# EasyEDA Pro project ProPrj_位置判断手环_2025-10-22.epro

# Schematic Schematic1
Board Name: Board1; Create Date: 2025-09-14; Page Name: P1; Project Name: 位置判断手环; Schematic Name: Schematic1; Update Date: 2025-09-14; Company: 嘉立创EDA; Page Size: A4; Version: V1.0
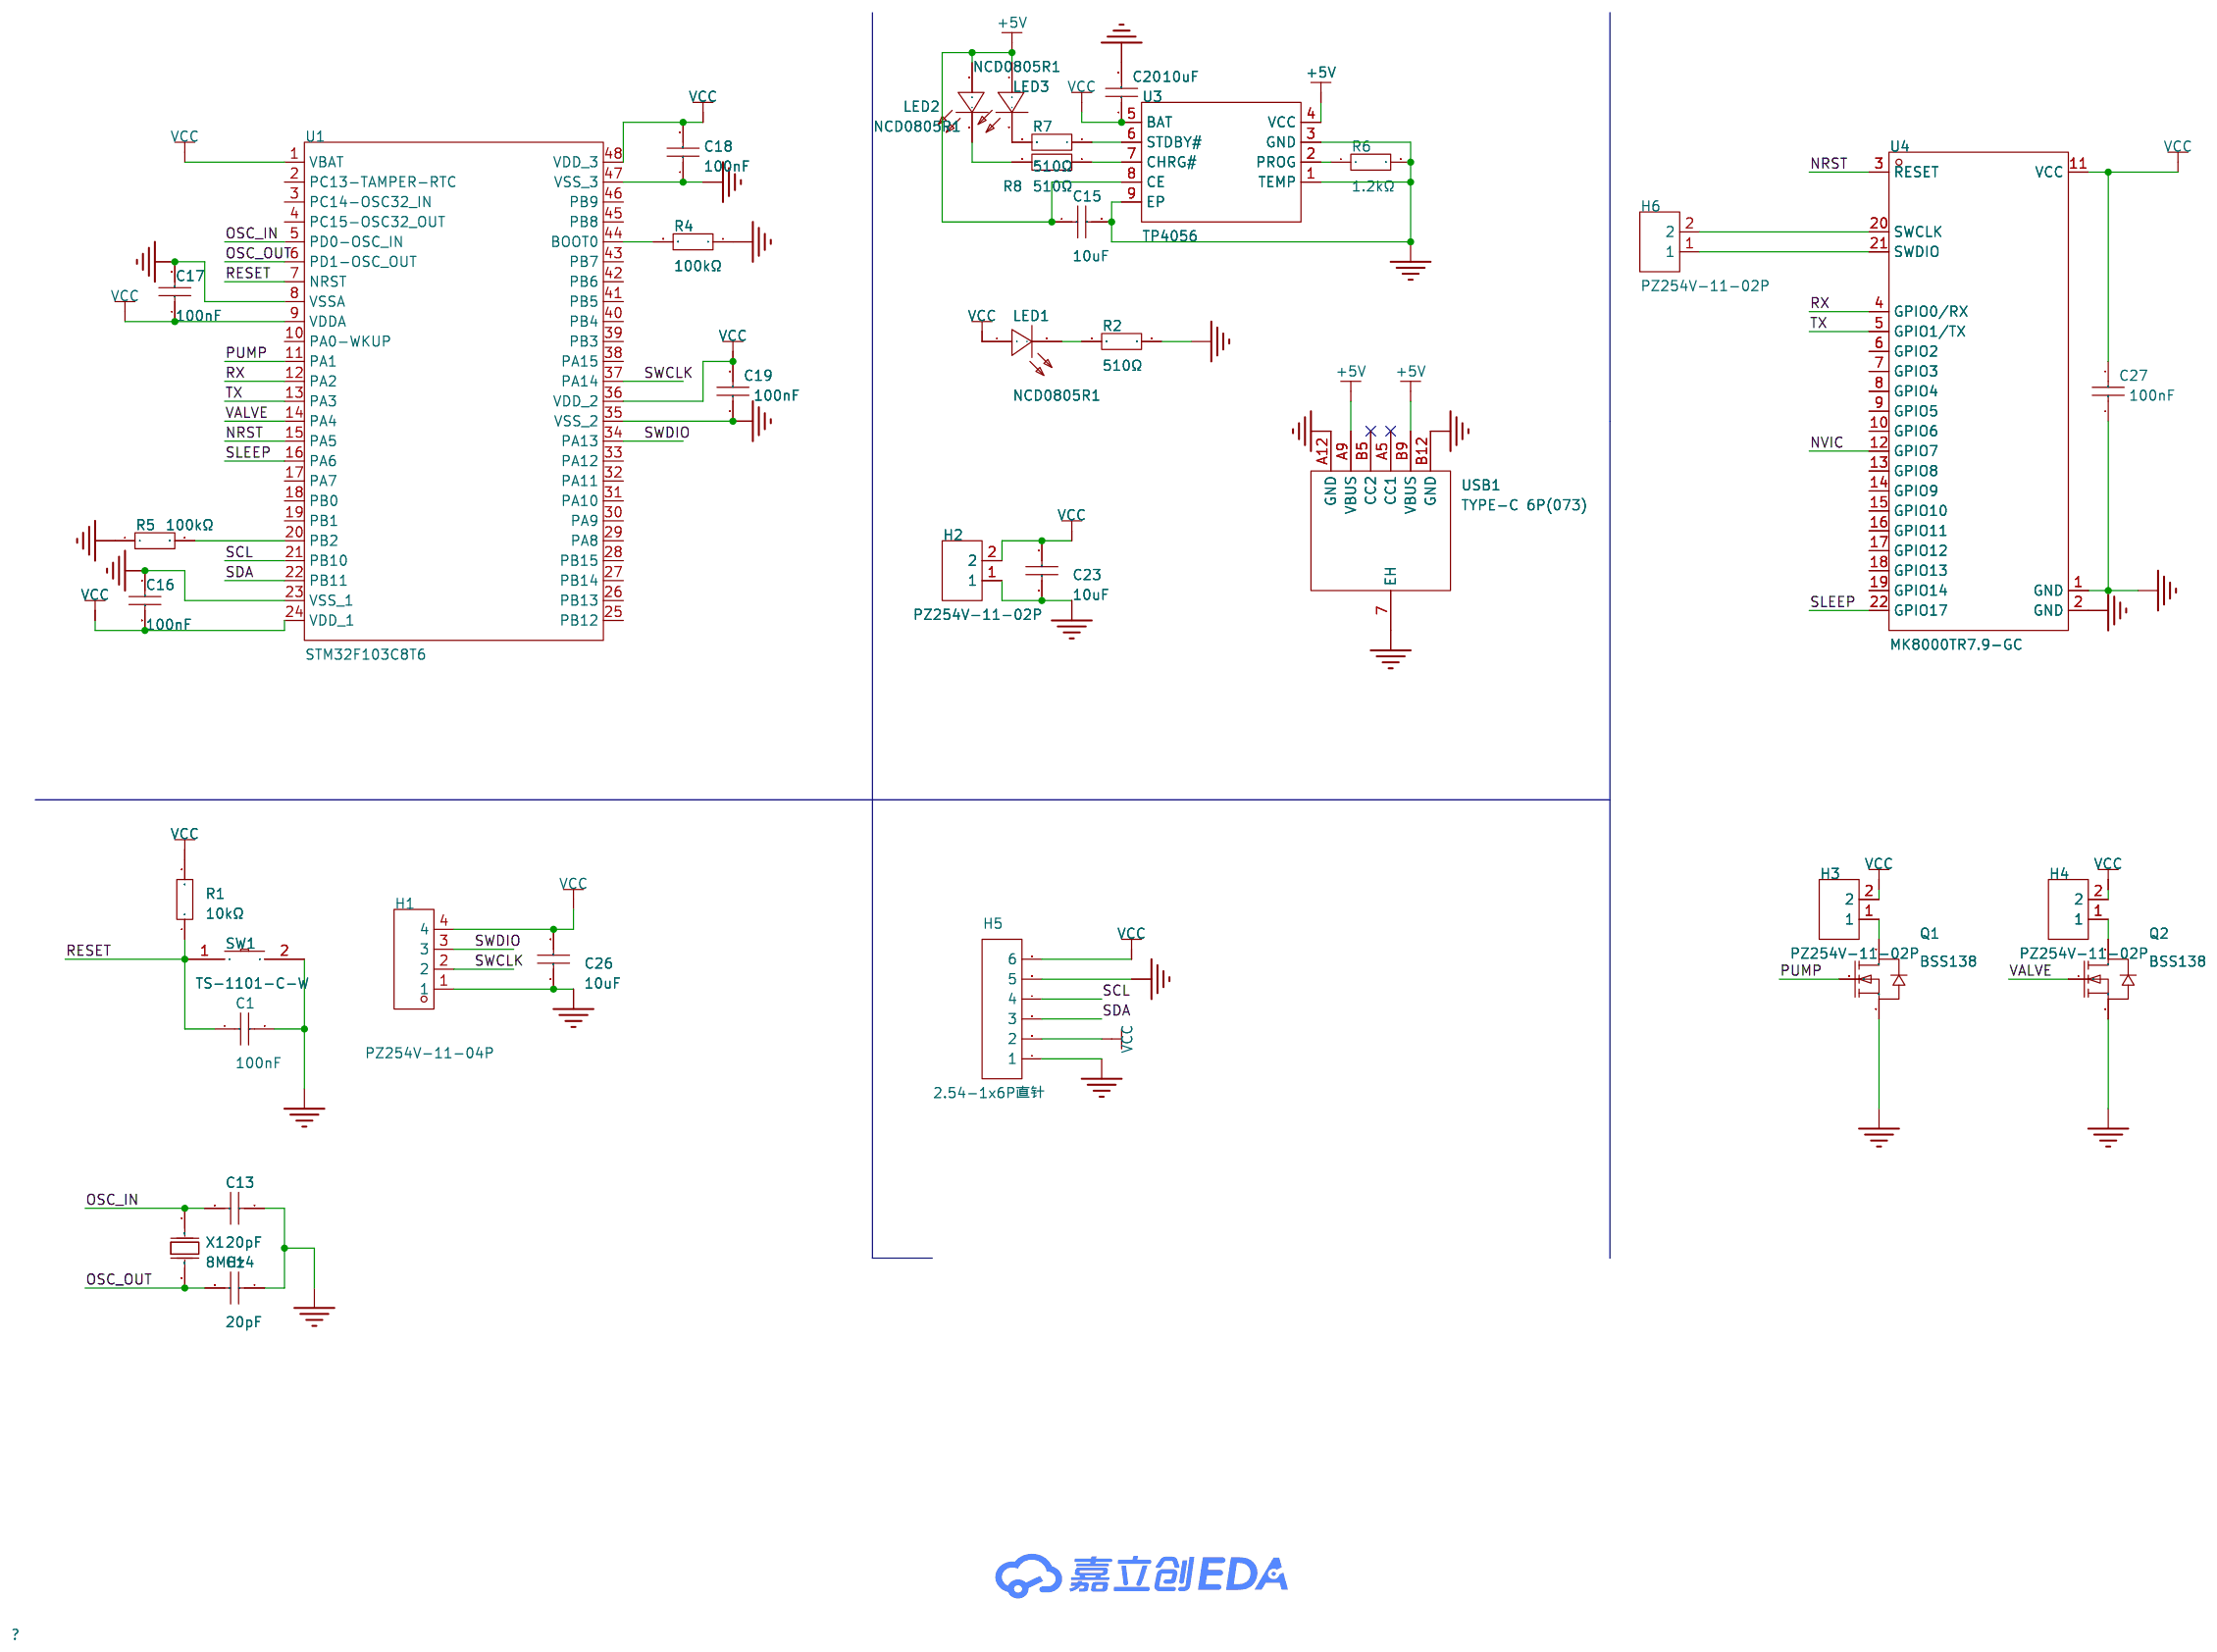
[diagram p0: schematic sheet]

## Parts
C1  100nF  [C0805]
C13  20pF  [C0805]
C14  20pF  [C0805]
C15  10uF  [C0805]
C16  100nF  [C0805]
C17  100nF  [C0805]
C18  100nF  [C0805]
C19  100nF  [C0805]
C20  10uF  [C0805]
C23  10uF  [C0805]
C26  10uF  [C0805]
C27  100nF  [C0805]
H1  PZ254V-11-04P  [HDR-TH_4P-P2.54-V-M]
H2  PZ254V-11-02P  [HDR-TH_2P-P2.54-V-M]
H3  PZ254V-11-02P  [HDR-TH_2P-P2.54-V-M]
H4  PZ254V-11-02P  [HDR-TH_2P-P2.54-V-M]
H5  2.54-1x6P直针  [HDR-TH_6P-P2.54-V-M-1]
H6  PZ254V-11-02P  [HDR-TH_2P-P2.54-V-M]
LED1  NCD0805R1  [LED0805-R-RD]
LED2  NCD0805R1  [LED0805-R-RD]
LED3  NCD0805R1  [LED0805-R-RD]
Q1  BSS138  [SOT-23-3_L2.9-W1.3-P1.90-LS2.4-BR]
Q2  BSS138  [SOT-23-3_L2.9-W1.3-P1.90-LS2.4-BR]
R1  10kΩ  [R0805]
R2  510Ω  [R0805]
R4  100kΩ  [R0805]
R5  100kΩ  [R0805]
R6  1.2kΩ  [R0603]
R7  510Ω  [R0805]
R8  510Ω  [R0805]
SW1  TS-1101-C-W  [SW-SMD_L6.0-W3.3-LS8.0]
U1  STM32F103C8T6  [LQFP-48_L7.0-W7.0-P0.50-LS9.0-BL]
U3  TP4056  [ESOP-8_L4.9-W3.9-P1.27-LS6.0-BL-EP]
U4  MK8000TR7.9-GC  [COMM-SMD_L26.3-W16.1_MK8000TR7.9-GC]
USB1  TYPE-C 6P(073)  [TYPE-C-SMD_TYPE-C-6P-073]
X1  8MHz  [CRYSTAL-SMD_L11.5-W4.8-LS12.7]

## Library data of the parts
C1 C16-C19 C27 = CL21B104KBCNNNC: 容值:100nF;精度:±10%;额定电压:50V;材质(温度系数):X7R;; LCSC Part Name: 100nF ±10% 50V; Supplier Part: C1711; Manufacturer: SAMSUNG(三星); Supplier Footprint: 0805; JLCPCB Part Class: 扩展库; Datasheet: https://atta.szlcsc.com/upload/public/pdf/source/20160218/1457707763339.pdf; Supplier: LCSC; Tolerance: ±10%; Voltage Rated: 50V; Temperature Coefficient: X7R
C13 C14 = CL21C200JBANNNC: 容值:20pF;精度:±5%;额定电压:50V;材质(温度系数):C0G;; LCSC Part Name: 20pF ±5% 50V; Supplier Part: C1798; Manufacturer: SAMSUNG(三星); Supplier Footprint: 0805; JLCPCB Part Class: 基础库; Datasheet: https://atta.szlcsc.com/upload/public/pdf/source/20160218/1457707763339.pdf; Supplier: LCSC; Tolerance: ±5%; Voltage Rated: 50V; Temperature Coefficient: C0G
C15 C20 C23 C26 = CL21A106KOQNNNE: 容值:10uF;精度:±10%;额定电压:16V;温度系数:X5R;; LCSC Part Name: 10uF ±10% 16V; Supplier Part: C1713; Manufacturer: SAMSUNG(三星); Supplier Footprint: 0805; JLCPCB Part Class: 扩展库; Datasheet: https://item.szlcsc.com/datasheet/CL21A106KOQNNNE/2065.html; Supplier: LCSC; Tolerance: ±10%; Voltage Rating: 16V; Temperature Coefficient: X5R
H1 = PZ254V-11-04P: 插针结构:1x4P;间距:2.54mm;行距:-;圆针/方针:方针;安装类型:直插;排数:单排;总PIN位数:4P;额定电流:3A;额定电压:250V;配合针长度:6mm;塑高:2.5mm;端接针长度:3mm;触头材质:-;工作温度范围:-40℃~+105℃;颜色:黑色;; LCSC Part Name: 间距:2.54mm 1x4P 直插 方针; Supplier Part: C2691448; Manufacturer: XFCN(兴飞); Supplier Footprint: 插件,P=2.54mm; JLCPCB Part Class: 扩展库; Datasheet: https://atta.szlcsc.com/upload/public/pdf/source/20200309/C492403_F9F19131791D08044AD4F84F8E751A34.pdf; Supplier: LCSC; Pin Structure: 1x4P; Pitch: 2.54mm; Circluar Pins/Square Pins: 方针; Mounting Type: 直插; Number of Rows: 单排; Number of Pins: 4P; Current Rating (Max): 3A; Voltage Rating (Max): 250V; Length of Mating Pin: 6mm; Insulation Height: 2.5mm; Length of End Connection Pin: 3mm; Operating Temperature Range: -40℃~+105℃; Color: 黑色
H2-H4 H6 = PZ254V-11-02P: 插针结构:1x2P;间距:2.54mm;行距:-;圆针/方针:方针;安装方式:直插;排数:单排;总PIN位数:2P;额定电流:-;额定电压:-;配合针长度:6mm;塑高:2.5mm;端接针长度:3mm;触头材质:黄铜;触头镀层:-;工作温度:-40℃~+105℃;颜色:黑色;; LCSC Part Name: 1x2P 间距:2.54mm 方针 直插; Supplier Part: C492401; Manufacturer: XFCN(兴飞); Supplier Footprint: 插件,P=2.54mm; JLCPCB Part Class: 扩展库; Datasheet: https://item.szlcsc.com/datasheet/PZ254V-11-02P/502957.html; Supplier: LCSC; Pin Structure: 1x2P; Pitch: 2.54mm; Circluar Pins/Square Pins: 方针; Mounting Type: 直插; Number of Rows: 单排; Number of Pins: 2P; Length of Mating Pin: 6mm; Insulation Height: 2.5mm; Length of End Connection Pin: 3mm; Contact Material: 黄铜; Operating Temperature: -40℃~+105℃; Color: 黑色
H5 = 2.54-1x6P直针: 插针结构:1x6P;间距:2.54mm;行距:-;圆针/方针:方针;安装方式:直插;排数:单排;总PIN位数:6P;额定电流:3A;额定电压:-;配合针长度:-;塑高:-;触头材质:黄铜;触头镀层:-;工作温度:-40℃~+105℃;颜色:黑色;; LCSC Part Name: 1x6P 间距:2.54mm 方针 直插; Supplier Part: C37208; Manufacturer: BOOMELE(博穆精密); Supplier Footprint: 插件,P=2.54mm; JLCPCB Part Class: 扩展库; Datasheet: https://atta.szlcsc.com/upload/public/pdf/source/20250115/42A019761A40C8B839643401D8CA5A96.pdf; Supplier: LCSC; Pin Structure: 1x6P; Pitch: 2.54mm; Circluar Pins/Square Pins: 方针; Mounting Type: 直插; Number of Rows: 单排; Number of Pins: 6P; Current Rating: 3A; Contact Material: 黄铜; Operating Temperature: -40℃~+105℃; Color: 黑色
LED1-LED3 = NCD0805R1: 灯头类型:-;发光颜色:红色;正向电压(VF):1.6V~2.6V;功率:65mW;正向电流:20mA;主波长:615nm~630nm;二极管配置:独立二极管;透镜颜色:无色透明透镜;色温:-;发光强度:67mcd~195mcd;发光角度:130°;载带方式:-;工作温度:-30℃~+85℃;; Supplier Part: C84256; Manufacturer: 国星光电; Supplier Footprint: 0805; JLCPCB Part Class: 基础库; Datasheet: https://atta.szlcsc.com/upload/public/pdf/source/20200820/C84256_F0A75A43B3EAD75808600A0514C76B99.pdf; Supplier: LCSC; Emitted Color: 红色; Forward Voltage (VF): 1.6V~2.6V; Power Dissipation: 65mW; Forward Current: 20mA; Dominant Wavelength: 615nm~630nm; Diode Configuration: 独立二极管; Lens Color: 无色透明透镜; Luminous Intensity: 67mcd~195mcd; Viewing Angle: 130°; Operating Temperature: -30℃~+85℃
Q1 Q2 = BSS138_C7420339: 数量:1个N沟道;漏源电压(Vdss):50V;连续漏极电流(Id):340mA;导通电阻(RDS(on)):1.1Ω@10V；1.2Ω@4.5V;耗散功率(Pd):350mW;阈值电压(Vgs(th)):1.2V@250uA;; LCSC Part Name: 1个N沟道 耐压:50V 电流:340mA; Supplier Part: C7420339; Manufacturer: R+O(宏嘉诚); Supplier Footprint: SOT-23; JLCPCB Part Class: 扩展库; Datasheet: https://item.szlcsc.com/datasheet/BSS138/8397161.html; Supplier: LCSC; Number: 1个N沟道; Drain to Source Voltage: 50V; Current - Continuous Drain(Id): 340mA; RDS(on): 1.1Ω@10V；1.2Ω@4.5V; Pd - Power Dissipation: 350mW; Gate Threshold Voltage (Vgs(th)): 1.2V@250uA; Gate Charge(Qg): 1.7nC@10V; Input Capacitance(Ciss): 17.5pF@25V; Reverse Transfer Capacitance (Crss@Vds): 6.5pF@25V; Operating Temperature: -55℃~+150℃; Type: N沟道
R1 = 0805W8F1002T5E_C17414: 电阻类型:厚膜电阻;阻值:10kΩ;精度:±1%;功率:125mW;工作电压:150V;温度系数:±100ppm/℃;; LCSC Part Name: 10kΩ ±1% 125mW 厚膜电阻; Supplier Part: C17414; Manufacturer: UNI-ROYAL(厚声); Manufacturer Part: 0805W8F1002T5E; Supplier Footprint: 0805; JLCPCB Part Class: 基础库; Datasheet: https://atta.szlcsc.com/upload/public/pdf/source/20200306/C422600_1E6D84923E4A46A82E41ADD87F860B5C.pdf; Supplier: LCSC; Type: 厚膜电阻; Tolerance: ±1%; Power(Watts): 125mW; Voltage-Supply(Max): 150V; Temperature Coefficient: ±100ppm/℃; Operating Temperature: -55℃~+155℃
R2 R7 R8 = 0805W8F5100T5E: 电阻类型:厚膜电阻;阻值:510Ω;精度:±1%;功率:125mW;最大工作电压:150V;温度系数:±100ppm/℃;; LCSC Part Name: 510Ω ±1% 125mW 厚膜电阻; Supplier Part: C17734; Manufacturer: UNI-ROYAL(厚声); Supplier Footprint: 0805; JLCPCB Part Class: 基础库; Datasheet: https://atta.szlcsc.com/upload/public/pdf/source/20200306/C422600_1E6D84923E4A46A82E41ADD87F860B5C.pdf; Supplier: LCSC; Type: 厚膜电阻; Tolerance: ±1%; Power(Watts): 125mW; Overload Voltage (Max): 150V; Temperature Coefficient: ±100ppm/℃; Operating Temperature Range: -55℃~+155℃
R4 R5 = 0805W8F1003T5E: 电阻类型:厚膜电阻;阻值:100kΩ;精度:±1%;功率:125mW;工作电压:150V;温度系数:±100ppm/℃;; LCSC Part Name: 100kΩ ±1% 125mW 厚膜电阻; Supplier Part: C149504; Manufacturer: UNI-ROYAL(厚声); Supplier Footprint: 0805; JLCPCB Part Class: 基础库; Datasheet: https://atta.szlcsc.com/upload/public/pdf/source/20200306/C422600_1E6D84923E4A46A82E41ADD87F860B5C.pdf; Supplier: LCSC; Type: 厚膜电阻; Tolerance: ±1%; Power(Watts): 125mW; Voltage-Supply(Max): 150V; Temperature Coefficient: ±100ppm/℃; Operating Temperature: -55℃~+155℃
R6 = 0603WAF1201T5E: 电阻类型:厚膜电阻;阻值:1.2kΩ;精度:±1%;功率:100mW;工作电压:75V;温度系数:±100ppm/℃;; LCSC Part Name: 1.2kΩ ±1% 100mW 厚膜电阻; Supplier Part: C22765; Manufacturer: UNI-ROYAL(厚声); Supplier Footprint: 0603; JLCPCB Part Class: 基础库; Datasheet: https://item.szlcsc.com/datasheet/0603WAF1201T5E/23492.html; Supplier: LCSC; Type: 厚膜电阻; Tolerance: ±1%; Power(Watts): 100mW; Voltage-Supply(Max): 75V; Temperature Coefficient: ±100ppm/℃; Operating Temperature: -55℃~+155℃
SW1 = TS-1101-C-W: 电路结构:单刀单掷;按钮形状:矩形按钮;作用力:260gf;安装方式:立贴;开关长度:6mm;开关宽度:3.6mm;开关高度:2.5mm;带支架:不带;触点电流:50mA;额定电压(AC):-;额定电压(DC):12V;额定功率:-;绝缘电阻:-;带灯:无;机械寿命:5万次;; LCSC Part Name: 6*3.6*2.5mm 立贴 轻触开关; Supplier Part: C318938; Manufacturer: XKB Connectivity(中国星坤); Supplier Footprint: SMD; JLCPCB Part Class: 扩展库; Datasheet: https://atta.szlcsc.com/upload/public/pdf/source/20200227/C318938_C2E53B1EEDE37D980A33616AC086DE53.pdf; Supplier: LCSC; Circuit: 单刀单掷; Actuator Style: 矩形按钮; Operating Force: 260gf; Mounting Style: 立贴; Switch Length: 6mm; Switch Width: 3.6mm; Switch Height: 2.5mm; Strike Gundam: 不带; Contact Current: 50mA; Voltage Rating (DC): 12V; Actuator/Cap Color: 白色带淡绿; With Lamp: 无; Mechanical Life: 5万次; Operating Temperature: -30℃~+85℃
U1 = STM32F103C8T6: CPU内核:ARM-M3;CPU最大主频:72MHz;应用领域:-;; LCSC Part Name: 主流增强型ARM Cortex-M3 MCU，具有64 KB Flash、72 MHz CPU、电机控制、USB和CAN; Supplier Part: C8734; Manufacturer: ST(意法半导体); Supplier Footprint: LQFP-48(7x7); JLCPCB Part Class: 扩展库; Datasheet: https://item.szlcsc.com/datasheet/STM32F103C8T6/9243.html; Supplier: LCSC; CPU Core: ARM-M3; CPU Maximum Speed: 72MHz; Program Storage Size: 64KB; Program Memory Type: FLASH; Number of I/O: 37; ADC (Bit): 12bit; Voltage - Supply: 2V~3.6V
U3 = TP4056_C725790: 工作电压:3.7V~6.5V;最大充电电流:1A;电池类型:锂离子;电池节数:1;; LCSC Part Name: 1A独立式线性锂离子电池充电器; Supplier Part: C725790; Manufacturer: UMW(友台半导体); Supplier Footprint: ESOP-8; JLCPCB Part Class: 扩展库; Datasheet: https://item.szlcsc.com/datasheet/TP4056/772193.html; Supplier: LCSC; The Chip Type: 线性充电芯片; Voltage - Supply: 3.7V~6.5V; Charge Current - Max: 1A; Charging Saturation Voltage: 4.2V; Type of Battery: 锂离子; Number of Cells: 1; Operating Temperature: -40℃~+85℃; Battery Temperature Detection: 支持; 0V Battery Charge: 支持; Supply Current (Iq): 35uA
U4 = MK8000TR7.9-GC: 国产UWB测距模块电子围栏应用; Supplier Part: C42382001; Manufacturer: Silicontra(硅传科技); Supplier Footprint: SMD,26.3x15.1mm; JLCPCB Part Class: Extended Part; Datasheet: https://atta.szlcsc.com/upload/public/pdf/source/20241115/1BBDFCDE45D079C44B86411E68911EA9.pdf; Supplier: LCSC
USB1 = TYPE-C 6P(073): 连接器类型:Type-C;标准:USB 3.1;公母:母;安装方式:卧贴;触点数量:6P;端口数量:1;额定电流 - 电源:3A;工作温度范围:-25℃~+85℃;; LCSC Part Name: Type-C 母 卧贴; Supplier Part: C668623; Manufacturer: SHOU HAN(首韩); Supplier Footprint: SMD; JLCPCB Part Class: 扩展库; Datasheet: https://atta.szlcsc.com/upload/public/pdf/source/20200618/C668623_A4B260DED7AC1949BAC6AE39E9F4CD80.pdf; Supplier: LCSC; Connector Type: Type-C; Standard: USB 3.1; Gender: 母; Mounting Style: 卧贴; Number of Contacts: 6P; Number of Ports: 1; Current Rating - Power (Max): 3A; Operating Temperature Range: -25℃~+85℃; Rated Voltage (Max): 5V; Connect-Disconnect Life: 1万次; Core Colour: 黑色
X1 = X49SM8MSD2SC: 晶振类型:贴片晶振;频率:8MHz;常温频差:±20ppm;负载电容:20pF;频率稳定度:±30ppm;; LCSC Part Name: HC-49SMD 8MHZ 2P 49SMD 20PF ±20PPM -20~70℃（±30PPM）; Supplier Part: C12674; Manufacturer: YXC(扬兴晶振); Supplier Footprint: HC-49S-SMD; JLCPCB Part Class: 基础库; Datasheet: https://item.szlcsc.com/datasheet/X49SM8MSD2SC/13310.html; Supplier: LCSC; Type: 贴片晶振; Normal temperature Frequency Tolerance: ±20ppm; Load Capacitance: 20pF; Frequency Stability: ±30ppm; Operating Temperature: -20℃~+70℃

## Nets
+5V: C15.1 LED2.1(+) LED3.1(+) U3.4(VCC) U3.8(CE) USB1.A9(VBUS) USB1.B9(VBUS)
GND: C1.2 C13.1 C14.1 C15.2 C16.1 C17.2 C18.1 C19.1 C20.2 C23.1 C26.1 C27.1 H1.1 H2.1 H5.1 H5.5 Q1.2(S) Q2.2(S) R2.2 R4.1 R5.1 R6.2 SW1.2 U1.8(VSSA) U1.23(VSS_1) U1.35(VSS_2) U1.47(VSS_3) U3.1(TEMP) U3.3(GND) U3.9(EP) U4.1(GND) U4.2(GND) USB1.7(EH) USB1.A12(GND) USB1.B12(GND)
VCC: C16.2 C17.1 C18.2 C19.2 C20.1 C23.2 C26.2 C27.2 H1.4 H2.2 H3.2 H4.2 H5.2 H5.6 LED1.1(+) R1.2 U1.1(VBAT) U1.9(VDDA) U1.24(VDD_1) U1.36(VDD_2) U1.48(VDD_3) U3.5(BAT) U4.11(VCC)
NRST: U1.15(PA5) U4.3(RESET)
NVIC: U4.12(GPIO7)
OSC_IN: C13.2 U1.5(PD0-OSC_IN) X1.1(OSC1)
OSC_OUT: C14.2 U1.6(PD1-OSC_OUT) X1.2(OSC2)
PUMP: Q1.1(G) U1.11(PA1)
RESET: C1.1 R1.1 SW1.1 U1.7(NRST)
RX: U1.12(PA2) U4.4(GPIO0/RX)
SCL: H5.4 U1.21(PB10)
SDA: H5.3 U1.22(PB11)
SLEEP: U1.16(PA6) U4.22(GPIO17)
SWCLK: H1.2 U1.37(PA14)
SWDIO: H1.3 U1.34(PA13)
TX: U1.13(PA3) U4.5(GPIO1/TX)
VALVE: Q2.1(G) U1.14(PA4)
$1N1122: R4.2 U1.44(BOOT0)
$1N1418: LED1.2(-) R2.1
$1N1827: R5.2 U1.20(PB2)
$1N2005: R6.1 U3.2(PROG)
$1N2241: R7.1 U3.6(STDBY#)
$1N2366: R8.1 U3.7(CHRG#)
$1N4541: H3.1 Q1.3(D)
$1N4547: H4.1 Q2.3(D)
$1N4625: LED3.2(-) R7.2
$1N4629: LED2.2(-) R8.2
$1N6746: H6.2 U4.20(SWCLK)
$1N6750: H6.1 U4.21(SWDIO)

Not connected (* = marked no-connect by the designer): U1 2(PC13-TAMPER-RTC) 3(PC14-OSC32_IN) 4(PC15-OSC32_OUT) 10(PA0-WKUP) 17(PA7) 18(PB0) 19(PB1) 25(PB12) 26(PB13) 27(PB14) 28(PB15) 29(PA8) 30(PA9) 31(PA10) 32(PA11) 33(PA12) 38(PA15) 39(PB3) 40(PB4) 41(PB5) 42(PB6) 43(PB7) 45(PB8) 46(PB9); U4 6(GPIO2) 7(GPIO3) 8(GPIO4) 9(GPIO5) 10(GPIO6) 13(GPIO8) 14(GPIO9) 15(GPIO10) 16(GPIO11) 17(GPIO12) 18(GPIO13) 19(GPIO14); USB1 A5(CC1)* B5(CC2)*

# Board PCB1
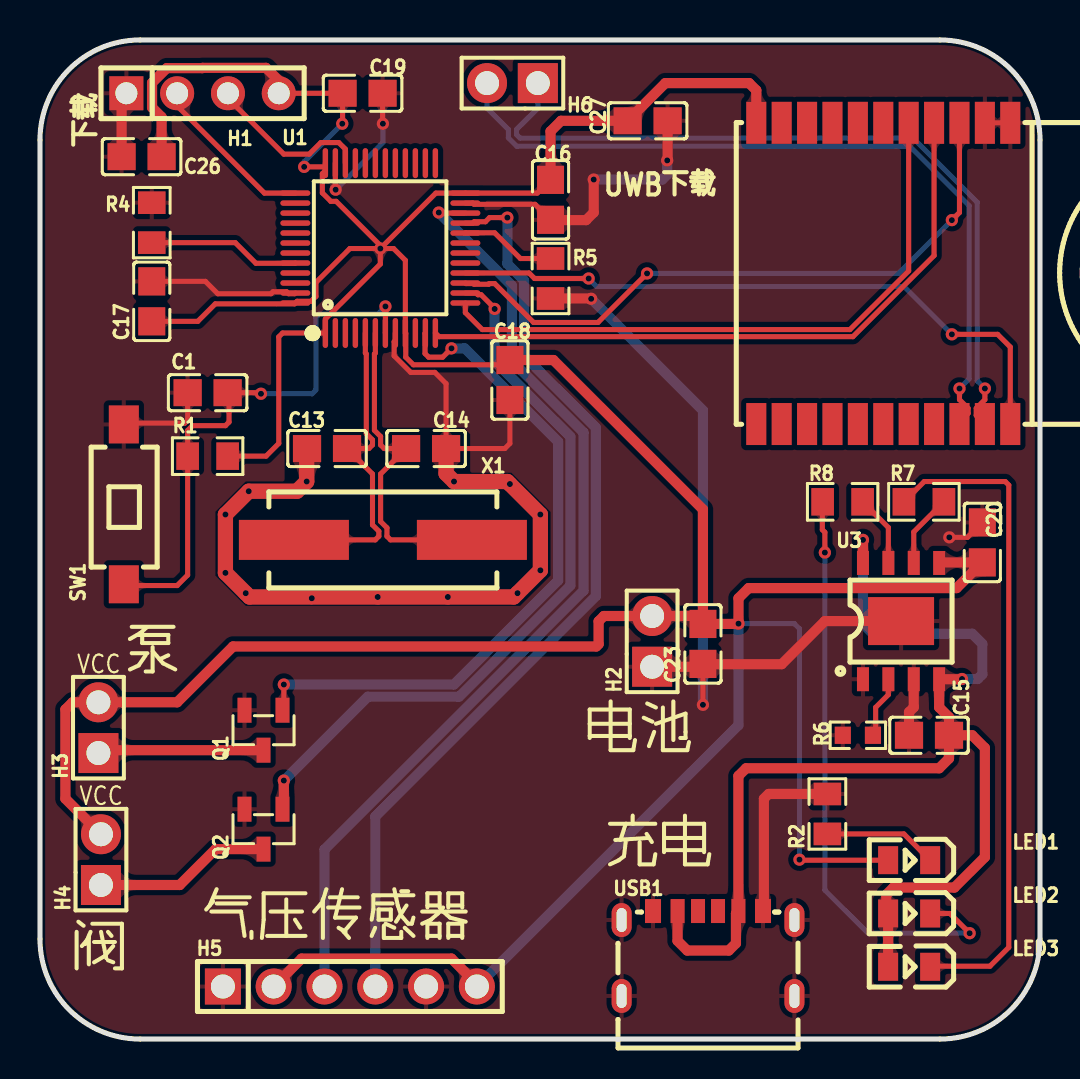
[diagram p1: board, top side]
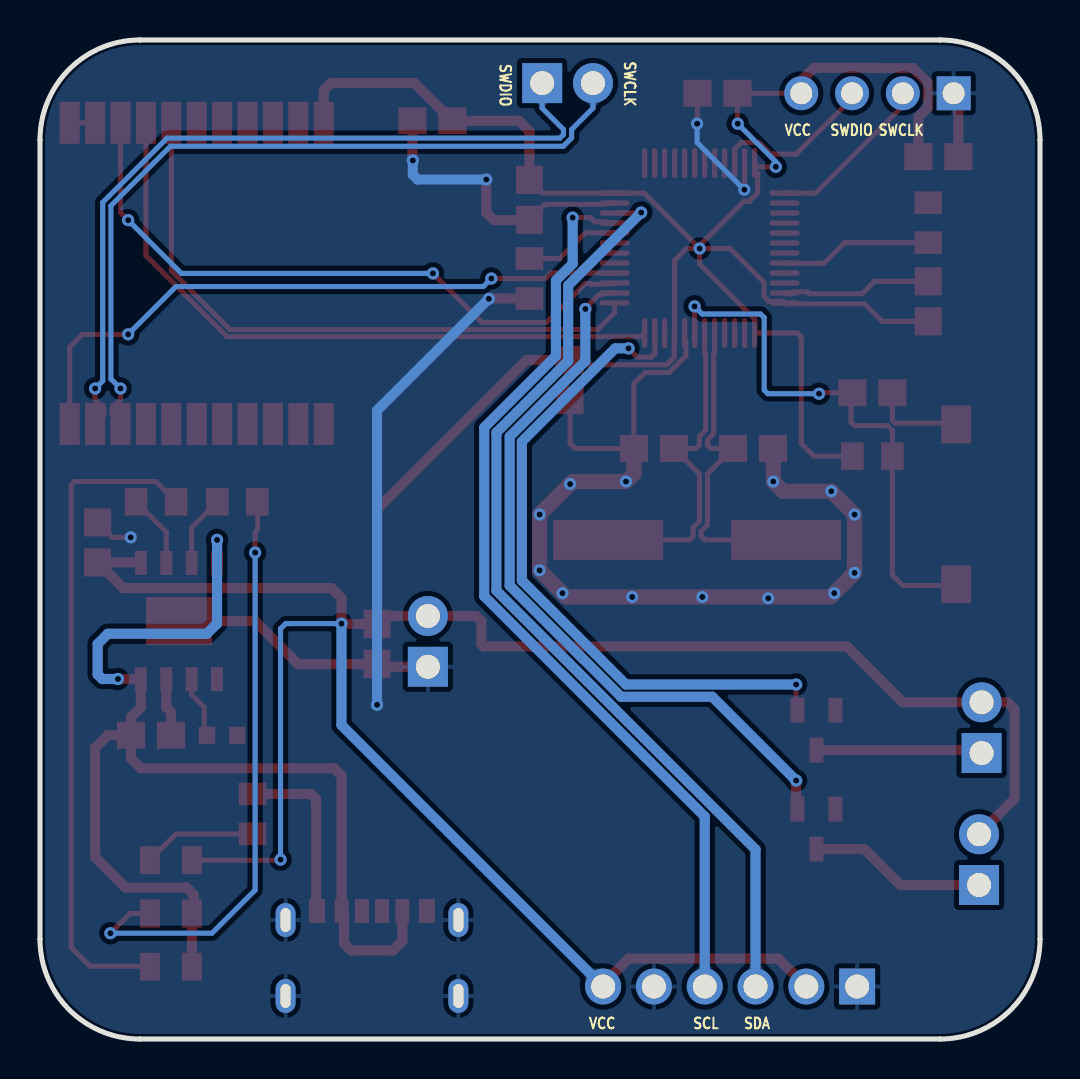
[diagram p2: board, bottom side, seen from below]

Outline 50 x 50 mm; copper layers: Top Layer, Bottom Layer. Coordinates in mm from the lower left corner of the outline.
Outline path: 0,45 0,5 arc(1.46,1.46) 5,0 45,0 arc(48.54,1.46) 50,5 50,45 arc(48.54,48.54) 45,50 5,50 arc(1.46,48.54) 0,45
Stack: Top Layer 0.035mm / Dielectric1 1.51mm FR4 er 4.5 / Bottom Layer 0.035mm

## Design rules (mm)
net OSC_IN: DP1
net OSC_OUT: DP1
net SWCLK: DP2
net SWDIO: DP2
net $1N6750: DP3
net $1N6746: DP3
template: JLCPCB Capability(Two Layers Board)
spacing copperThickness1oz (default): track to track 0.102, other pairs 0.152 to 0.3
spacing copperThickness2oz: track to track 0.203, other pairs 0.152 to 0.3
track width copperThickness1oz (default): min 0.127, default 0.254, max 2.54
track width copperThickness2oz: min 0.203, default 0.254, max 2.54
differential pair differentialPair (default): width min 0.127, default 0.254, max 2.54; gap min 0.152, default 0.152
via viaSize (default): diameter min 0.5, default 0.61, max 10; hole min 0.3, default 0.305, max 6.3

## Placement (name value [footprint] x y rotation side)
C1  100nF  [C0805]  8.38 32.35 180 top
C13  20pF  [C0805]  14.35 29.55 0 top
C14  20pF  [C0805]  19.3 29.55 180 top
C15  10uF  [C0805]  44.45 15.2 180 top
C16  100nF  [C0805]  25.53 42 90 top
C17  100nF  [C0805]  5.59 36.92 90 top
C18  100nF  [C0805]  23.49 32.98 90 top
C19  100nF  [C0805]  16.13 47.33 180 top
C20  10uF  [C0805]  47.12 24.85 90 top
C23  10uF  [C0805]  33.15 19.77 90 top
C26  10uF  [C0805]  5.08 44.16 0 top
C27  100nF  [C0805]  30.38 45.95 180 top
H1  PZ254V-11-04P  [HDR-TH_4P-P2.54-V-M]  8.13 47.33 0 top
H2  PZ254V-11-02P  [HDR-TH_2P-P2.54-V-M]  30.61 19.9 90 top
H3  PZ254V-11-02P  [HDR-TH_2P-P2.54-V-M]  2.92 15.58 90 top
H4  PZ254V-11-02P  [HDR-TH_2P-P2.54-V-M]  3.05 8.98 90 top
H5  2.54-1x6P直针  [HDR-TH_6P-P2.54-V-M-1]  15.49 2.63 0 top
H6  PZ254V-11-02P  [HDR-TH_2P-P2.54-V-M]  23.62 47.84 180 top
LED1  NCD0805R1  [LED0805-R-RD]  43.46 8.95 180 top
LED2  NCD0805R1  [LED0805-R-RD]  43.46 6.28 180 top
LED3  NCD0805R1  [LED0805-R-RD]  43.46 3.62 180 top
Q1  BSS138  [SOT-23-3_L2.9-W1.3-P1.90-LS2.4-BR]  11.18 15.46 90 top
Q2  BSS138  [SOT-23-3_L2.9-W1.3-P1.90-LS2.4-BR]  11.18 10.5 90 top
R1  10kΩ  [R0805]  8.38 29.17 0 top
R2  510Ω  [R0805]  39.37 11.26 90 top
R4  100kΩ  [R0805]  5.59 40.86 270 top
R5  100kΩ  [R0805]  25.53 38.06 90 top
R6  1.2kΩ  [R0603]  40.89 15.2 180 top
R7  510Ω  [R0805]  44.2 26.89 180 top
R8  510Ω  [R0805]  40.13 26.89 180 top
SW1  TS-1101-C-W  [SW-SMD_L6.0-W3.3-LS8.0]  4.19 26.76 90 top
U1  STM32F103C8T6  [LQFP-48_L7.0-W7.0-P0.50-LS9.0-BL]  17.02 39.59 0 top
U3  TP4056  [ESOP-8_L4.9-W3.9-P1.27-LS6.0-BL-EP]  43.05 20.92 0 top
U4  MK8000TR7.9-GC  [COMM-SMD_L26.3-W16.1_MK8000TR7.9-GC]  42.16 38.32 270 top
USB1  TYPE-C 6P(073)  [TYPE-C-SMD_TYPE-C-6P-073]  33.4 4.28 0 top
X1  8MHz  [CRYSTAL-SMD_L11.5-W4.8-LS12.7]  17.14 24.98 0 top

## Footprints (pads in the part's own frame, mm; a bottom-side part is the same pattern mirrored in y, then rotated)
C0805
  rect 1.41x1.35 smd: 1(-1,0) 2(1,0)
COMM-SMD_L26.3-W16.1_MK8000TR7.9-GC
  rect 2.102x1.002 smd: 1(-7.537,6.35) 2(-7.537,5.08) 3(-7.537,3.81) 4(-7.537,2.54) 5(-7.537,1.27) 6(-7.537,0) 7(-7.537,-1.27) 8(-7.537,-2.54) 9(-7.537,-3.81) 10(-7.537,-5.08) 11(-7.537,-6.35) 12(7.537,-6.35) 13(7.537,-5.08) 14(7.537,-3.81) 15(7.537,-2.54) 16(7.537,-1.27) 17(7.537,0) 18(7.537,1.27) 19(7.537,2.54) 20(7.537,3.81) 21(7.537,5.08) 22(7.537,6.35)
CRYSTAL-SMD_L11.5-W4.8-LS12.7
  rect 5.5x2 smd: 1(-4.45,0) 2(4.45,0)
ESOP-8_L4.9-W3.9-P1.27-LS6.0-BL-EP
  rect 0.6x1.2 smd: 1(-1.905,-2.909) 2(-0.635,-2.909) 3(0.635,-2.909) 4(1.905,-2.909) 5(1.905,2.909) 6(0.635,2.909) 7(-0.635,2.909) 8(-1.905,2.909)
  rect 3.3x2.4 smd: 9(0,0)
HDR-TH_2P-P2.54-V-M
  rect 2x2 hole 1.2: 1(-1.27,0)
  round 2 hole 1.2: 2(1.27,0)
HDR-TH_4P-P2.54-V-M
  rect 1.7x1.7 hole 1.1: 1(-3.81,0)
  round 1.7 hole 1.1: 2(-1.27,0) 3(1.27,0) 4(3.81,0)
HDR-TH_6P-P2.54-V-M-1
  rect 1.8x1.8 hole 1.2: 1(-6.35,0)
  round 1.8 hole 1.2: 2(-3.81,0) 3(-1.27,0) 4(1.27,0) 5(3.81,0) 6(6.35,0)
LED0805-R-RD
  rect 1x1.399 smd: 1(1.05,0) 2(-1.05,0)
LQFP-48_L7.0-W7.0-P0.50-LS9.0-BL
  oval 0.27x1.5 smd: 1(-2.75,-4.25) 2(-2.25,-4.25) 3(-1.75,-4.25) 4(-1.25,-4.25) 5(-0.75,-4.25) 6(-0.25,-4.25) 7(0.25,-4.25) 8(0.75,-4.25) 9(1.25,-4.25) 10(1.75,-4.25) 11(2.25,-4.25) 12(2.75,-4.25) 25(2.75,4.25) 26(2.25,4.25) 27(1.75,4.25) 28(1.25,4.25) 29(0.75,4.25) 30(0.25,4.25) 31(-0.25,4.25) 32(-0.75,4.25) 33(-1.25,4.25) 34(-1.75,4.25) 35(-2.25,4.25) 36(-2.75,4.25)
  oval 1.5x0.27 smd: 13(4.25,-2.75) 14(4.25,-2.25) 15(4.25,-1.75) 16(4.25,-1.25) 17(4.25,-0.75) 18(4.25,-0.25) 19(4.25,0.25) 20(4.25,0.75) 21(4.25,1.25) 22(4.25,1.75) 23(4.25,2.25) 24(4.25,2.75) 37(-4.25,2.75) 38(-4.25,2.25) 39(-4.25,1.75) 40(-4.25,1.25) 41(-4.25,0.75) 42(-4.25,0.25) 43(-4.25,-0.25) 44(-4.25,-0.75) 45(-4.25,-1.25) 46(-4.25,-1.75) 47(-4.25,-2.25) 48(-4.25,-2.75)
R0603
  rect 0.806x0.864 smd: 1(-0.753,0) 2(0.753,0)
R0805
  rect 1.133x1.377 smd: 1(-1,0) 2(1,0)
SOT-23-3_L2.9-W1.3-P1.90-LS2.4-BR
  rect 1.25x0.7 smd: 1(1,-0.95) 2(1,0.95) 3(-1,0)
SW-SMD_L6.0-W3.3-LS8.0
  rect 1.9x1.5 smd: 1(-4,0) 2(4,0)
TYPE-C-SMD_TYPE-C-6P-073
  oval 1x1.7 hole 0.5x1.2: 7(-4.32,1.675) 7(-4.32,-2.125) 7(4.32,1.675) 7(4.32,-2.125)
  rect 0.7x1.2 smd: A5(-0.5,2.125) A9(1.52,2.125) B5(0.5,2.125) B9(-1.52,2.125)
  rect 0.8x1.2 smd: A12(2.75,2.125) B12(-2.75,2.125)

## Nets
As in the schematic.

Pads without a net: U1 2 3 4 10 17 18 19 25 26 27 28 29 30 31 32 33 38 39 40 41 42 43 45 46; U4 6 7 8 9 10 13 14 15 16 17 18 19; USB1 A5 B5

## Via types
v1: diameter 0.61, hole 0.305, Top Layer to Bottom Layer, 43 vias

## Routing (per net, layer and track width the routed paths; a pad name or vN(x,y) marks a point on that pad's centre or on a via; arc(x,y) is an arc through that point)
+5V: length 60.6
  Top Layer w0.508: USB1.B9 31.88,6.4 31.88,4.91 32.36,4.43 34.44,4.43 34.8,4.79 34.8,6.28 USB1.A9 34.92,13.17 35.31,13.55 44.96,13.55 45.45,14.04 C15.1 ; LED3.1 LED2.1 42.31,6.38 42.31,7.22 42.67,7.58 45.72,7.58 47.24,9.11 47.24,14.57 46.61,15.2 C15.1 ; U3.8 v1(41.15,24.98) ; C15.1 45.45,16.11 44.96,16.6 U3.4 46.09,18.01 v1(46.1,18.02)
  Bottom Layer w0.508: v1(41.15,24.98) 41.15,20.79 41.66,20.28 46.61,20.28 47.12,19.77 47.12,18.25 46.89,18.02 v1(46.1,18.02)
GND: length 141.6
  Top Layer w0.254: U1.8 17.77,34.96 17.71,34.9 17.71,34.19 18.53,33.36 19.74,33.36 20.3,32.8 C14.1 23.24,29.55 23.49,29.81 C18.1 ; v1(45.47,25.11) 46.37,25.11 C20.2 ; C16.1 24.75,41.77 21.71,41.77 21.64,41.84 U1.23 ; U4.2 U4.1 ; U1.35 14.77,42.52 v1(14.78,42.51) ; C19.1 17.13,45.82 v1(17.14,45.81) ; C1.2 7.38,30.97 7.24,30.82 4.26,30.82 SW1.2 ; C23.1 v1(33.15,16.73) ; C17.2 8.27,37.92 8.89,37.3 11.55,37.3 11.65,37.4 12.33,37.4 12.43,37.3 12.73,37.3 U1.47
  Top Layer w0.508: H2.1 33,18.63 C23.1 33.16,18.76 37.08,18.76 39.24,20.92 U3.9 ; USB1.A12 36.2,6.45 36.2,12.03 36.43,12.26 R2.2 ; v1(31.36,43.97) 31.38,43.99 C27.1 ; R5.1 27.54,37.06 v1(27.56,37.05) ; H1.1 4.08,47.09 C26.1 ; C15.2 43.45,16.36 43.69,16.6 U3.3 ; v1(27.69,43.01) 27.69,41.36 27.3,40.98 25.54,40.98 C16.1
  Top Layer w0.762: C14.1 20.3,28.3 v1(20.7,27.9) 23.37,27.9 v1(23.49,27.77) v1(25.02,26.25) v1(25.02,23.46) v1(23.88,22.31) 23.69,22.12 v1(20.39,22.12) v1(16.89,22.12) 10.48,22.12 v1(10.29,22.31) v1(9.27,23.33) v1(9.27,26.25) v1(10.44,27.42) 12.85,27.42 v1(13.33,27.9) 13.33,29.54 C13.1
  Bottom Layer w0.254: v1(17.14,45.81) 17.14,44.87 v1(14.78,42.51)
  Bottom Layer w0.508: v1(27.56,37.05) 33.15,31.46 v1(33.15,16.73) ; v1(27.69,43.01) 31.11,43.01 31.36,43.26 v1(31.36,43.97)
  vias: v1(13.59,22.06)
VCC: length 224.8
  Top Layer w0.254: C18.2 23.26,33.74 18.67,33.74 18.29,34.12 18.29,35.32 U1.9 18.27,38.97 17.68,39.56 v1(17.02,39.56) ; v1(37.97,8.98) 38,8.95 LED1.1 ; 14.27,43.69 14.27,43.46 14.12,43.31 14.12,42.35 14.54,41.92 14.81,41.92 17.02,39.71 v1(17.02,39.56) ; 14.27,43.69 U1.36 ; 14.27,43.69 14.22,43.65 v1(13.21,43.65) ; C17.1 7.89,35.92 8.76,36.79 12.72,36.79 12.85,36.92 13.55,36.92 13.8,37.16 13.8,37.86 15.49,39.56 v1(17.02,39.56) ; R1.2 11.3,29.17 11.94,29.81 11.94,35.14 12.13,35.34 U1.1 14.27,36.04 17.02,38.79 v1(17.02,39.56) ; C16.2 24.86,42.34 U1.24 19.79,42.34 v1(17.02,39.56) ; v1(15.11,45.81) 15.13,45.82 C19.2 H1.4
  Top Layer w0.508: C23.2 33.15,26.5 25.67,33.98 C18.2 ; C23.2 32.75,21.17 H2.2 28.19,21.17 27.93,20.91 27.93,19.76 27.81,19.65 9.65,19.65 6.86,16.85 H3.2 1.63,16.85 1.27,16.49 1.27,12.03 H4.2 ; C23.2 34.91,20.77 v1(34.92,20.79) 34.92,22.06 35.43,22.57 45.83,22.57 C20.1 44.99,23.85 U3.5 ; C26.2 6.08,46.14 5.6,46.62 5.6,47.85 6.34,48.59 8.11,48.59 8.13,48.6 11.3,48.6 11.94,47.97 H1.4 ; C16.2 25.53,45.43 26.05,45.95 C27.2 31.27,47.84 35.45,47.84 35.81,47.48 U4.11 ; H5.2 13.08,4.03 20.57,4.03 21.84,2.76 H5.6
  Bottom Layer w0.254: v1(13.21,43.65) 13.21,43.9 v1(15.11,45.81) ; v1(37.97,8.98) 37.97,20.54 37.72,20.79 v1(34.92,20.79)
  Bottom Layer w0.508: v1(34.92,20.79) 34.92,15.71 H5.6
NRST: length 32.3
  Top Layer w0.254: v1(30.35,38.32) 27.9,35.86 24.68,35.86 22.73,37.81 22.47,37.81 22.43,37.77 21.71,37.77 21.67,37.81 21.3,37.81 U1.15 ; U4.3 45.97,41.36 v1(45.59,40.98)
  Bottom Layer w0.254: v1(45.59,40.98) 42.93,38.32 v1(30.35,38.32)
OSC_IN: length 16.5
  Top Layer w0.254: U1.5 16.27,34.33 16.32,34.28 16.32,30.3 16.62,29.99 16.62,29.73 16.44,29.55 C13.2 16.62,28.28 16.62,25.73 16.94,25.41 16.94,25.16 16.76,24.98 X1.1
OSC_OUT: length 16.5
  Top Layer w0.254: U1.6 16.77,34.33 16.72,34.28 16.72,30.46 17.03,30.15 17.03,29.73 17.21,29.55 C14.2 17.03,28.28 17.03,25.9 17.35,25.58 17.35,25.16 17.53,24.98 21.6,24.98
PUMP: length 34
  Top Layer w0.254: Q1.1 12.19,16.52 v1(12.19,17.74) ; v1(20.57,34.57) 20.13,34.12 19.43,34.12 19.25,34.3 19.25,35.32 U1.11
  Bottom Layer w0.508: v1(12.19,17.74) 20.7,17.74 25.91,22.95 25.91,29.9 21.24,34.57 v1(20.57,34.57)
RESET: length 27.6
  Top Layer w0.254: v1(11.05,32.29) 11,32.35 C1.1 9.45,32.28 9.45,30.88 9.27,30.7 7.62,30.7 7.38,30.46 R1.1 7.38,23.22 6.86,22.69 4.26,22.69 SW1.1 ; U1.7 17.27,35.34 v1(17.27,36.66)
  Bottom Layer w0.254: v1(11.05,32.29) 13.61,32.29 13.79,32.47 13.79,36.1 13.97,36.28 16.89,36.28 v1(17.27,36.66)
RX: length 33.3
  Top Layer w0.254: U1.12 19.95,35.15 40.64,35.15 44.7,39.21 U4.4
SCL: length 47.1
  Top Layer w0.254: v1(23.37,41.11) 22.48,41.11 22.27,40.9 21.71,40.9 21.64,40.84 U1.21
  Bottom Layer w0.508: H5.4 16.76,11.14 27.79,22.16 27.79,30.6 24.2,34.19 24.2,37.96 23.37,38.8 v1(23.37,41.11)
SDA: length 48.4
  Top Layer w0.254: U1.22 19.97,41.34 v1(19.94,41.36)
  Bottom Layer w0.508: H5.3 14.22,9.49 27.18,22.44 27.18,30.35 23.59,33.94 23.59,37.71 v1(19.94,41.36)
SLEEP: length 32.6
  Top Layer w0.254: U4.22 48.51,34.63 47.88,35.27 v1(45.59,35.27) ; v1(27.43,38.06) 24.73,38.06 24.45,38.34 U1.16
  Bottom Layer w0.254: v1(27.43,38.06) 27.83,37.66 43.2,37.66 v1(45.59,35.27)
SWCLK: length 8.4
  Top Layer w0.254: H1.2 6.86,46.7 11.22,42.34 U1.37
SWDIO: length 8.4
  Top Layer w0.254: U1.34 15.27,44.54 14.94,44.86 14.04,44.86 13.46,44.28 12.19,44.28 9.4,47.08 H1.3
TX: length 31.6
  Top Layer w0.254: U1.13 21.27,36.35 22.11,35.51 40.5,35.51 43.43,38.44 U4.5
VALVE: length 37.1
  Top Layer w0.254: v1(22.73,36.54) 22.73,36.57 22.05,37.25 21.89,37.25 21.81,37.34 U1.14
  Top Layer w0.508: Q2.1 12.19,11.57 v1(12.19,12.94)
  Bottom Layer w0.508: v1(22.73,36.54) 22.73,33.93 26.52,30.15 26.52,22.7 20.95,17.13 16.39,17.13 v1(12.19,12.94)
$1N1122: length 7.6
  Top Layer w0.254: R4.2 9.76,39.86 10.8,38.82 12.76,38.82 U1.44
$1N1418: length 5.7
  Top Layer w0.254: R2.1 43.19,10.26 LED1.2
$1N1827: length 4.8
  Top Layer w0.254: R5.2 24.02,39.06 22.73,40.35 21.28,40.35 U1.20
$1N2005: length 3.1
  Top Layer w0.254: U3.2 42.42,17.23 41.78,16.6 41.78,15.34 R6.1
$1N2241: length 3.7
  Top Layer w0.254: R7.1 43.69,25.38 U3.6
$1N2366: length 3.6
  Top Layer w0.254: U3.7 42.42,25.6 R8.1
$1N4541: length 8.3
  Top Layer w0.508: H3.1 3.06,14.46 Q1.3
$1N4547: length 8.9
  Top Layer w0.508: Q2.3 8.78,9.5 6.98,7.71 H4.1
$1N4625: length 33.2
  Top Layer w0.254: R7.2 44.21,27.9 48.26,27.9 48.44,27.72 48.44,4.59 47.5,3.64 44.54,3.64 LED3.2
$1N4629: length 30
  Top Layer w0.254: LED2.2 45.49,6.28 v1(46.48,5.3) ; v1(39.24,24.35) 39.24,25.36 39.12,25.49 39.12,26.87 R8.2
  Bottom Layer w0.254: v1(39.24,24.35) 39.24,7.45 41.4,5.3 v1(46.48,5.3)
$1N6746: length 39.1
  Top Layer w0.254: U4.20 45.97,30.88 46.41,31.31 46.41,31.57 45.97,32 v1(45.97,32.56)
  Bottom Layer w0.254: H6.2 22.35,46.59 23.42,45.52 23.42,45.1 23.84,44.68 43.48,44.68 46.46,41.7 46.46,33.04 v1(45.97,32.56)
$1N6750: length 39.1
  Top Layer w0.254: v1(47.24,32.56) 47.24,32 46.81,31.57 46.81,31.21 U4.21
  Bottom Layer w0.254: H6.1 24.89,46.59 23.83,45.52 23.83,45.27 24.01,45.09 43.65,45.09 46.86,41.87 46.86,32.94 v1(47.24,32.56)

## Copper pours and planes (outline as drawn; the poured copper is in the pictures)
GND on Top Layer: -3.05,55.21 61.85,55.21 61.85,-7.66 -3.05,-7.66
GND on Bottom Layer: -5.33,57.49 57.53,57.49 57.53,-3.85 -5.33,-3.85

Small or netless copper shapes (teardrops, artwork), in the pictures only: 145 on Top Layer, 31 on Bottom Layer

## Text on the board
Bottom Silkscreen Layer: SWCLK | SWDIO | VCC | SDA | SCL
Top Silkscreen Layer: VCC | UWB下载 | 下载 | 阀 | 泵 | 气压传感器 | 电池 | 充电
